# EAGLE design circle_humidity (EAGLE 7.4.0)
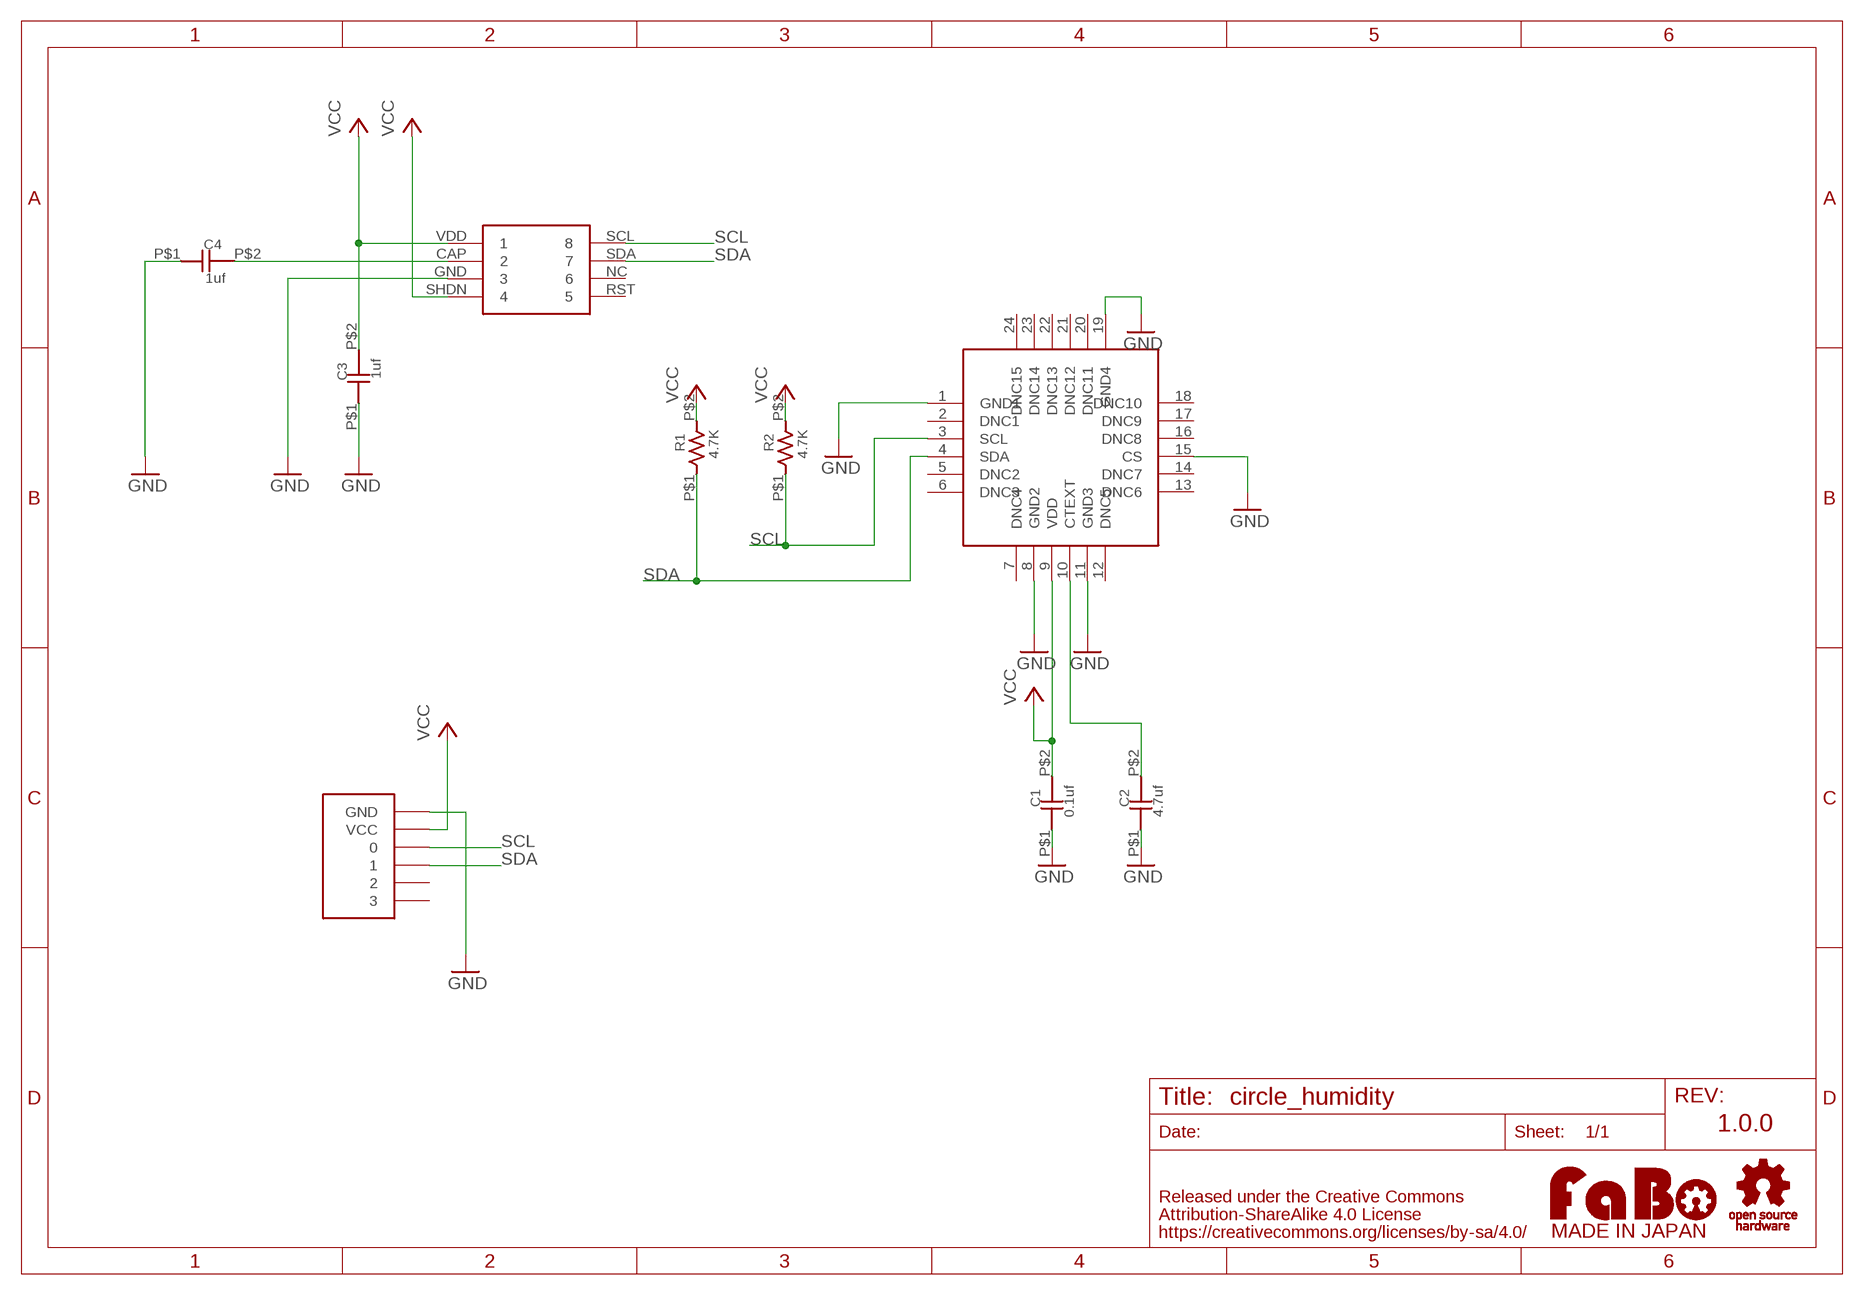
[diagram p0: schematic, sheet 1]

## Parts
C1  0.1uf  0402  [0402]
C2  4.7uf  0402  [0402]
C3  1uf  0402  [0402]
C4  1uf  0402  [0402]
R1  4.7K  0402  [0402]
R2  4.7K  0402  [0402]
SI1  SILICONLAB-SI7005  [SILICONLAB-SI7005]
U$2  LOGO_OSHW-S_BOTTOM  [LOGO_OSHW_S_BOTTOM]
U$3  I2C-MPL115A2  [I2C-MLP115A2]
U$4  LOGO_FABO-S_BOTTOM  [LOGO_FABO_S_BOTTOM]
U$5  FABO-NANO  [FABO-NANO]

## Nets
GND: C1.P$1 C2.P$1 C3.P$1 C4.P$1 SI1.1(GND1) SI1.8(GND2) SI1.11(GND3) SI1.15(CS) SI1.19(GND4) U$3.GND U$5.GND
N$1: C2.P$2 SI1.10(CTEXT)
N$2: C4.P$2 U$3.CAP
SCL: R2.P$1 SI1.3(SCL) U$3.SCL U$5.0
SDA: R1.P$1 SI1.4(SDA) U$3.SDA U$5.1
VCC: C1.P$2 C3.P$2 R1.P$2 R2.P$2 SI1.9(VDD) U$3.SHDN U$3.VDD U$5.VCC
Unconnected: SI1.2(DNC1) SI1.5(DNC2) SI1.6(DNC3) SI1.7(DNC4) SI1.12(DNC5) SI1.13(DNC6) SI1.14(DNC7) SI1.16(DNC8) SI1.17(DNC9) SI1.18(DNC10) SI1.20(DNC11) SI1.21(DNC12) SI1.22(DNC13) SI1.23(DNC14) SI1.24(DNC15) U$3.NC U$3.RST U$5.2 U$5.3

## Notes on the sheet
- 1.0.0

## Library data of the parts
C1-C4 = FaBo-Capacitor:0402: CAPACITOR 0402
R1 R2 = FaBo-Resistors:0402
SI1 = gclueSensor:SILICONLAB-SI7005
U$2 = FaBo-etc:LOGO_OSHW
U$3 = gclue:I2C-MPL115A2
U$4 = FaBo-etc:LOGO_FABO
U$5 = FaBo-Template:FABO-NANO

## Board
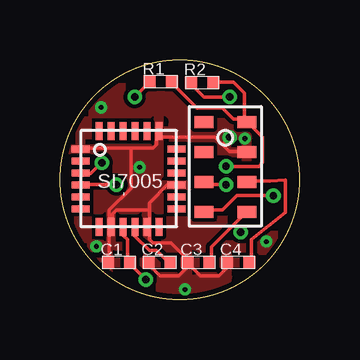
[diagram p1: board, top side]
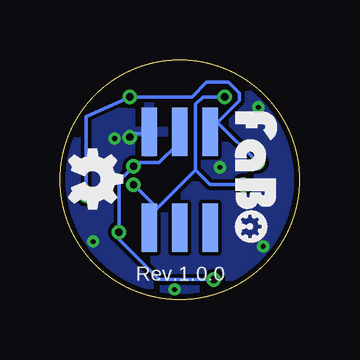
[diagram p2: board, bottom side, seen from below]

Size 10 x 10 mm. Coordinates in mm from the lower left corner, seen from the top.
Copper layers (1*16): Top 0.035mm / dielectric 1.5mm / Bottom 0.035mm
Design rules "Elecrow_2-layer_eagle_rule": minimum track width 6mil, minimum drill 12mil, track to track 6mil, track to pad 6mil, pad to pad 6mil, via to via 6mil, smd to smd 0mil, copper to edge 10mil, drill to drill 10mil, minimum pad ring 10mil, minimum via ring 6mil, stop-mask expansion 2mil, vias tented up to drill 100mil, thermal gap 10mil

### Footprints (pad centres in the part's own frame; a part is rotated, then mirrored left to right if it is on the bottom)
0402 = smd 0.5 x 0.5: P$1 -0.46,0; P$2 0.46,0
SILICONLAB-SI7005 = smd 0.75 x 0.3: 1 -2.01,1.23; 2 -2.01,0.73; 3 -2.01,0.23; 4 -2.01,-0.27; 5 -2.01,-0.77; 6 -2.01,-1.27; 13 1.99,-1.27; 14 1.99,-0.77; 15 1.99,-0.27; 16 1.99,0.23; 17 1.99,0.73; 18 1.99,1.23 | smd 0.3 x 0.75: 7 -1.23,-2.01; 8 -0.73,-2.01; 9 -0.23,-2.01; 10 0.27,-2.01; 11 0.77,-2.01; 12 1.27,-2.01; 19 1.27,1.99; 20 0.77,1.99; 21 0.27,1.99; 22 -0.23,1.99; 23 -0.73,1.99; 24 -1.23,1.99
I2C-MLP115A2 = smd 0.8 x 0.5: CAP -0.9,0.65; GND -0.9,-0.6; NC 0.9,-0.6; RST 0.9,-1.85; SCL 0.9,1.9; SDA 0.9,0.65; SHDN -0.9,-1.85; VDD -0.9,1.9
FABO-NANO = smd 0.635 x 2.032 bottom: 0 -1.27,2; 1 1.27,-2; 2 0,-2; 3 -1.27,-2; GND 1.27,2; VCC 0,2

### Placement (x,y rotation side)
C1  2.46,1.55 0 top
C2  4.16,1.55 0 top
C3  5.79,1.55 0 top
C4  7.44,1.55 0 top
R1  4.21,9.08 0 top
R2  5.94,9.06 0 top
SI1  2.87,5.05 0 top
U$2  8.63,5.03 90 top
U$3  6.91,5.56 180 top
U$4  2.69,5.05 90 top
U$5  5,5 0 top

### Tracks (layer width: path | path; a pad name or v marks a point on that pad's centre or on a via)
GND  (via drill 0.2, 0.3)
  Top 0.152: 5.41,1.44 4.95,0.99 4.19,0.99 3.73,1.44 C2.P$1 | 5.41,1.44 5.86,0.99 6.63,0.99 6.93,1.29 6.93,1.44 C4.P$1 | 5.41,1.44 C3.P$1 5.25,1.6 5.25,1.75 4.64,2.36 3.88,2.36 3.73,2.51 3.73,2.97 SI1.11 3.73,3.12 3.73,3.73 | C1.P$1 2.05,1.6 2.05,2.97 SI1.8 | 3.73,3.73 3.73,4.04 4.49,4.8 4.8,4.8 SI1.15 | 3.73,3.73 2.36,3.73 2.21,3.58 2.21,3.12 SI1.8 | 2.97,6.32 3.88,6.32 4.04,6.47 4.04,6.78 | 2.97,6.32 0.99,6.32 SI1.1 | 4.04,6.78 4.04,6.93 SI1.19 4.04,6.78 | 6.78,6.47 6.47,6.78 4.04,6.78 | 6.78,6.47 7.08,6.17 7.69,6.17 U$3.GND | 6.78,6.47 v7.08,6.78 | 2.97,6.32 2.97,4.64 2.05,3.73 2.05,3.12 SI1.8
  Bottom 0.152: v7.08,6.78 6.93,6.93 6.32,6.93 U$5.GND
  other vias: 1.72,8.02 3.32,5.52 7.72,6.72 5.22,0.42 1.52,2.22 8.62,2.42
  pour Bottom: -0.08,-0.08 9.92,-0.08 9.92,9.92 -0.08,9.92
  pour Top: -0.08,-0.08 9.92,-0.08 9.92,9.92 -0.08,9.92
N$1
  Top 0.152: C2.P$2 4.49,1.6 4.04,2.05 3.73,2.05 3.12,2.66 3.12,2.97 SI1.10
N$2
  Top 0.152: C4.P$2 8,1.6 8,2.51 9.42,3.63 9.42,4.99 8.76,4.95 7.84,4.95 U$3.CAP
SCL  (via drill 0.3)
  Top 0.152: v7.08,8.45 6.02,8.45 5.56,8.91 R2.P$1 | v1.75,5.71 1.29,5.25 0.99,5.25 SI1.3 | v8.91,4.34 7.39,4.34 6.78,3.73 6.02,3.73 U$3.SCL
  Bottom 0.152: 3.42,7.39 3.73,7.08 U$5.0 3.42,7.39 | 3.42,7.39 2.51,8.3 2.51,8.61 2.97,9.06 3.88,9.06 4.49,8.45 v7.08,8.45 8.91,7.63 v8.91,4.34 | 3.42,7.39 v1.75,5.71
SDA  (via drill 0.3)
  Top 0.152: v3.12,8.45 3.73,9.06 R1.P$1 | v2.36,4.8 0.99,4.8 SI1.4 | v6.93,4.8 6.02,4.8 U$3.SDA
  Bottom 0.152: v3.12,8.45 4.04,8.45 4.34,8.15 4.34,5.41 | 5.86,3.88 6.17,3.58 6.17,3.12 U$5.1 | 5.86,3.88 4.34,5.41 | v2.36,4.8 3.73,4.8 4.34,5.41 | v6.93,4.8 6.02,3.88 5.86,3.88
VCC  (via drill 0.3)
  Top 0.152: 7.69,7.54 7.24,7.54 6.78,8 5.71,8 4.8,8.91 4.8,9.06 R1.P$2 | 7.69,7.54 7.69,8.61 7.24,9.06 6.47,9.06 R2.P$2 | 7.69,7.54 U$3.SHDN 7.84,7.39 8.45,6.78 8.45,5.71 8.3,5.56 v6.93,5.56 | 7.24,3.12 7.69,3.58 U$3.VDD | 7.24,3.12 6.32,2.21 6.32,1.6 C3.P$2 | SI1.9 2.66,2.97 2.66,2.66 2.82,2.51 2.82,1.6 C1.P$2 2.97,1.44 v3.58,0.83 | v7.54,2.82 7.24,3.12
  Bottom 0.152: v3.58,0.83 5.86,0.83 7.54,2.51 v7.54,2.82 7.54,4.95 v6.93,5.56 6.78,5.71 5.86,5.71 5.1,6.47 5.1,6.93 U$5.VCC

### Text on the board
bPlace: Rev.1.0.0